# EAGLE design MKR485ShieldV3.0 (EAGLE 9.1.3)
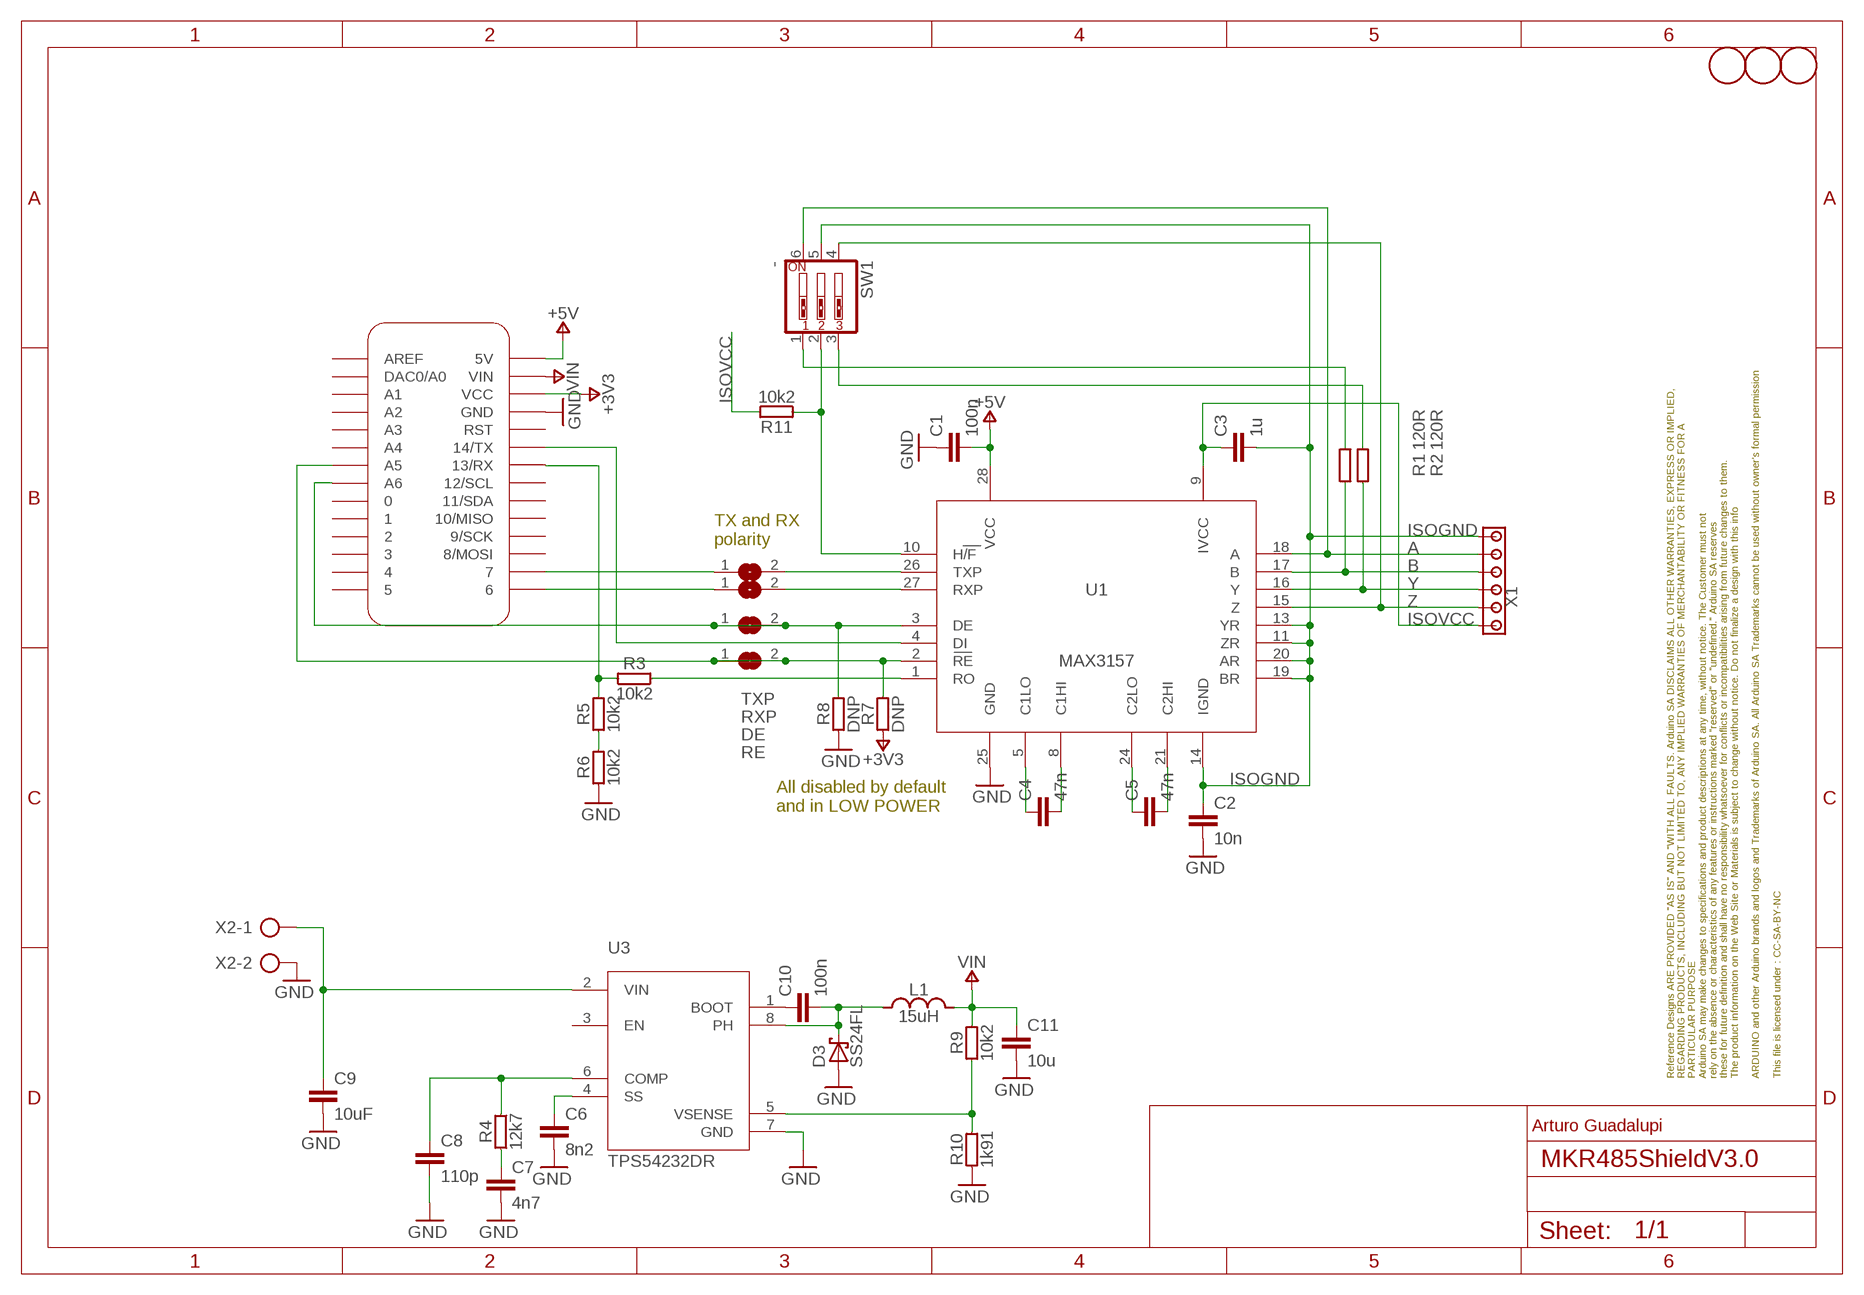
[diagram p0: schematic, sheet 1]

## Parts
C1  100n  C-100NF-0402  [0402-1005X55N]
C2  10n  C-10NF-0603  [0603-1608X90N]
C3  1u  C-1UF-0603  [0603-1608X90N]
C4  47n  C-47N-0402  [0402-1005X55N]
C5  47n  C-47N-0402  [0402-1005X55N]
C6  8n2  C-8N2-0402  [0402-1005X55N]
C7  4n7  C-4N7-0402  [0402-1005X55N]
C8  110p  C-110P-0402  [0402-1005X55N]
C9  10uF  C-10UF-1206  [C1206]
C10  100n  C-100NF-0402  [0402-1005X55N]
C11  10u  C-10UF-0603  [0603-1608X90N]
D3  SS24FL  [SOD123F]
DE  DNP  SJ  [SJ]
FD1  DNP  FIDUCIAL-1.5MM  [FD-1-1.5]
FD2  DNP  FIDUCIAL-1.5MM  [FD-1-1.5]
FD3  DNP  FIDUCIAL-1.5MM  [FD-1-1.5]
FRAME1  DNP  A4L-LOC  [FRAME]
L1  15uH  LSRN  [SRN6045]
MKR1  DNP  MKRBOARD-DNP-DIM  [MKRBOARD-DIM]
R1  120R  R-120R-0402  [0402-1005X55N]
R2  120R  R-120R-0402  [0402-1005X55N]
R3  10k2  R-10K2-0402  [0402-1005X55N]
R4  12k7  R-12K7-0402  [0402-1005X55N]
R5  10k2  R-10K2-0402  [0402-1005X55N]
R6  10k2  R-10K2-0402  [0402-1005X55N]
R7  DNP  R-DNP-0402  [0402-1005X55N]
R8  DNP  R-DNP-0402  [0402-1005X55N]
R9  10k2  R-10K2-0402  [0402-1005X55N]
R10  1k91  R-1K91-0402  [0402-1005X55N]
R11  10k2  R-10K2-0402  [0402-1005X55N]
RE  DNP  SJ  [SJ]
RXP  DNP  SJ  [SJ]
SW1  -  SW_DIP-3  [EDG-03]
TXP  DNP  SJ  [SJ]
U1  MAX3157  [TSSOP28]
U3  TPS54232DR  TPS54232  [SO08]
X1  -  SCREW6X2.54  [SCREW6X2.54]
X2  -  AK300/2  [AK300/2]

## Nets
+3V3: MKR1.VCC R7.1
+5V: C1.2 MKR1.5V U1.28(VCC)
A: SW1.6 U1.18(A) X1.5
B: R1.1 U1.17(B) X1.4
DE: DE.1 DE.2 MKR1.A6 R8.2 U1.3(DE)
GND: C1.1 C2.2 C6.2 C7.2 C8.2 C9.2 C11.2 D3.A MKR1.GND R6.1 R8.1 R10.1 U1.25(GND) U3.7(GND) X2.2
ISOGND: C2.1 C3.2 SW1.5 U1.11(ZR) U1.13(YR) U1.14(IGND) U1.19(BR) U1.20(AR) X1.6
ISOVCC: C3.1 R11.2 U1.9(IVCC) X1.1
N$1: TXP.2 U1.26(TXP)
N$2: RXP.2 U1.27(RXP)
N$3: R11.1 SW1.2 U1.10(H/F)
N$4: R2.2 SW1.3
N$5: MKR1.14(14/TX) U1.4(DI)
N$6: C4.1 U1.5(C1LO)
N$7: C4.2 U1.8(C1HI)
N$8: C5.1 U1.24(C2LO)
N$9: C5.2 U1.21(C2HI)
N$10: C7.1 R4.1
N$11: C8.1 R4.2 U3.6(COMP)
N$12: MKR1.13(13/RX) R3.1 R5.2
N$13: R1.2 SW1.1
N$16: C6.1 U3.4(SS)
N$17: R3.2 U1.1(RO)
N$18 [HV]: C9.1 U3.2(VIN) X2.1
N$19: C10.1 U3.1(BOOT)
N$20: C10.2 D3.C L1.1 U3.8(PH)
N$21: R9.1 R10.2 U3.5(VSENSE)
N$22: R5.1 R6.2
RE: MKR1.A5 R7.2 RE.1 RE.2 U1.2(RE)
RXP: MKR1.6 RXP.1
TXP: MKR1.7 TXP.1
VIN: C11.1 L1.2 MKR1.VIN R9.2
Y: R2.1 U1.16(Y) X1.3
Z: SW1.4 U1.15(Z) X1.2
Unconnected: MKR1.0 MKR1.1 MKR1.2 MKR1.3 MKR1.4 MKR1.5 MKR1.8(8/MOSI) MKR1.9(9/SCK) MKR1.10(10/MISO) MKR1.11(11/SDA) MKR1.12(12/SCL) MKR1.A0(DAC0/A0) MKR1.A1 MKR1.A2 MKR1.A3 MKR1.A4 MKR1.AREF MKR1.RST U3.3(EN)

## Notes on the sheet
- TX and RX
  polarity
- All disabled by default
  and in LOW POWER
- Arturo Guadalupi

## Library data of the parts
C1 C10 = Arduino-rcl:C: SMD Capacitor; CODE-ARDUINO: 0132; DATASHEET: http://www.tdk.com/pdf/TDKMLCCCapRange.pdf; DISTRIBUTOR-LINK: http://www.digikey.com/product-detail/en/tdk-corporation/C1005X5R1H104K050BB/445-5942-1-ND/2443982; DISTRIBUTOR-PN: 445-5942-1-ND; MANUFACTURER: TDK; MANUFACTURER-PN: C1005X5R1H104K050BB; NOTE: -
C2 = Arduino-rcl:C: SMD Capacitor; CODE-ARDUINO: 0142; DATASHEET: http://www.murata.com/~/media/webrenewal/support/library/catalog/products/capacitor/mlcc/c02e.pdf; DISTRIBUTOR-LINK: https://www.digikey.com/product-detail/en/murata-electronics-north-america/GRM188R71H103KA01D/490-1512-1-ND/587862; DISTRIBUTOR-PN: 490-1512-1-ND; MANUFACTURER: Murata; MANUFACTURER-PN: GRM188R71H103KA01D; NOTE: -
C3 = Arduino-rcl:C: SMD Capacitor; CODE-ARDUINO: 0133; DATASHEET: http://www.samsungsem.com/kr/support/product-search/mlcc/__icsFiles/afieldfile/2016/08/18/S_CL10B105KP8NNNC.pdf; DISTRIBUTOR-LINK: https://www.digikey.com/product-detail/en/samsung-electro-mechanics-america-inc/CL10B105KP8NNNC/1276-1946-1-ND/3890032; DISTRIBUTOR-PN: 1276-1946-1-ND; MANUFACTURER: Samsung; MANUFACTURER-PN: CL10B105KP8NNNC; NOTE: -
C4 C5 = Arduino-rcl:C: SMD Capacitor; CODE-ARDUINO: 2216; DATASHEET: http://www.murata.com/~/media/webrenewal/support/library/catalog/products/capacitor/mlcc/c02e.pdf; DISTRIBUTOR-LINK: https://www.digikey.com/product-detail/en/murata-electronics-north-america/GRM155R71E473KA88D/490-3254-1-ND/702795; DISTRIBUTOR-PN: 490-3254-1-ND; MANUFACTURER: Murata; MANUFACTURER-PN: GRM155R71E473KA88D; NOTE: -
C6 = Arduino-rcl:C: SMD Capacitor; CODE-ARDUINO: 2263; DATASHEET: http://www.yageo.com/documents/recent/UPY-GPHC_X7R_6.3V-to-50V_18.pdf; DISTRIBUTOR-LINK: https://www.digikey.com/product-detail/en/yageo/CC0402KRX7R7BB822/311-1041-1-ND/302958; DISTRIBUTOR-PN: 311-1041-1-ND; MANUFACTURER: Yageo; MANUFACTURER-PN: CC0402KRX7R7BB822; NOTE: -
C7 = Arduino-rcl:C: SMD Capacitor; CODE-ARDUINO: 2266; DATASHEET: http://search.murata.co.jp/Ceramy/image/img/A01X/partnumbering_e_01.pdf; DISTRIBUTOR-LINK: https://www.digikey.com/product-detail/en/murata-electronics-north-america/GRM155R71H472KA01J/490-8259-1-ND/4380553; DISTRIBUTOR-PN: 490-8259-1-ND; MANUFACTURER: Murata; MANUFACTURER-PN: GRM155R71H472KA01J; NOTE: -
C8 = Arduino-rcl:C: SMD Capacitor; CODE-ARDUINO: 2264; DATASHEET: http://search.murata.co.jp/Ceramy/image/img/A01X/G101/ENG/GRM1555C1H111GA01-01.pdf; DISTRIBUTOR-LINK: https://www.digikey.com/product-detail/en/murata-electronics-north-america/GRM1555C1H111GA01D/490-6195-1-ND/3845392; DISTRIBUTOR-PN: 490-6195-1-ND; MANUFACTURER: Murata; MANUFACTURER-PN: GRM1555C1H111GA01D; NOTE: -
C9 = Arduino-rcl:C: SMD Capacitor; CODE-ARDUINO: 2227; DATASHEET: https://product.tdk.com/info/en/catalog/datasheets/mlcc_commercial_general_en.pdf; DISTRIBUTOR-LINK: https://www.digikey.com/product-detail/en/tdk-corporation/C3216X7R1V106M160AC/445-8034-1-ND/2792174; DISTRIBUTOR-PN: 445-8034-1-ND; MANUFACTURER: TDK Corporation; MANUFACTURER-PN: C3216X7R1V106M160AC; NOTE: -
C11 = Arduino-rcl:C: SMD Capacitor; CODE-ARDUINO: 2213; DATASHEET: http://www.murata.com/~/media/webrenewal/support/library/catalog/products/capacitor/mlcc/c02e.pdf; DISTRIBUTOR-LINK: http://www.digikey.com/product-search/en?keywords=490-10728-1-ND; DISTRIBUTOR-PN: 490-10728-1-ND; MANUFACTURER: Murata; MANUFACTURER-PN: GRM188R61C106KAALD; NOTE: -
D3 = Arduino-diodes:SS24FL: Schotky diode; CODE-ARDUINO: 2262; DATASHEET: https://www.fairchildsemi.com/datasheets/SS/SS24FL.pdf; DISTRIBUTOR-LINK: https://www.digikey.com/product-detail/en/fairchild-on-semiconductor/SS24FL/SS24FLCT-ND/5305093; DISTRIBUTOR-PN: SS24FLCT-ND; MANUFACTURER: Fairchild; MANUFACTURER-PN: SS24FL
DE RE RXP TXP = Arduino-connectors:SJ: SMD solder JUMPER
FD1-FD3 = Arduino-utility:FIDUCIAL: Fiducial mount; CODE-ARDUINO: DNP; DATASHEET: DNP; DISTRIBUTOR-LINK: DNP; DISTRIBUTOR-PN: DNP; MANUFACTURER: DNP; MANUFACTURER-PN: DNP
FRAME1 = Arduino-utility:A4L-LOC: FRAME DIN A4, landscape with location and doc. field; CODE-ARDUINO: DNP; DATASHEET: DNP; DISTRIBUTOR-LINK: DNP; DISTRIBUTOR-PN: DNP; MANUFACTURER: DNP; MANUFACTURER-PN: DNP
L1 = Arduino-rcl:L: Inductors; CODE-ARDUINO: 2261; DATASHEET: http://pdf1.alldatasheet.com/datasheet-pdf/view/442254/BOURNS/SRN6045-150M.html; DISTRIBUTOR-LINK: https://www.digikey.com/product-detail/en/bourns-inc/SRN6045-150M/SRN6045-150MCT-ND/2756165; DISTRIBUTOR-PN: SRN6045-150M; MANUFACTURER: Bourns; MANUFACTURER-PN: SRN6045-150M
MKR1 = Arduino-utility:MKRBOARD: MKR board footprint; CODE-ARDUINO: DNP; DATASHEET: DNP; DISTRIBUTOR-LINK: DNP; DISTRIBUTOR-PN: DNP; MANUFACTURER: DNP; MANUFACTURER-PN: DNP
R1 R2 = Arduino-rcl:R: SMD Resistor; CODE-ARDUINO: 2278; DATASHEET: www.yageo.com.tw/exep/pages/download/literatures/PYu-R_INT-thick_7.pdf; DISTRIBUTOR-LINK: https://www.digikey.com/product-detail/en/yageo/RC0402JR-07120RL/311-120JRCT-ND/2827967; DISTRIBUTOR-PN: 311-120JRCT-ND; MANUFACTURER: Yageo; MANUFACTURER-PN: RC0402JR-07120RL; NOTE: NO
R3 R5 R6 R9 R11 = Arduino-rcl:R: SMD Resistor; CODE-ARDUINO: 2265; DATASHEET: www.yageo.com.tw/exep/pages/download/literatures/PYu-R_INT-thick_7.pdf; DISTRIBUTOR-LINK: https://www.digikey.com/product-detail/en/yageo/RT0402DRD0710K2L/311-2129-1-ND/6128548; DISTRIBUTOR-PN: 311-2129-1-ND; MANUFACTURER: Yageo; MANUFACTURER-PN: RT0402DRD0710K2L; NOTE: NO
R4 = Arduino-rcl:R: SMD Resistor; CODE-ARDUINO: 2260; DATASHEET: www.yageo.com.tw/exep/pages/download/literatures/PYu-R_INT-thick_7.pdf; DISTRIBUTOR-LINK: https://www.digikey.com/product-detail/en/yageo/RC0402FR-0712K7L/YAG2964CT-ND/5281829; DISTRIBUTOR-PN: YAG2964CT-ND; MANUFACTURER: Yageo; MANUFACTURER-PN: RC0402FR-0712K7L; NOTE: NO
R7 R8 = Arduino-rcl:R: SMD Resistor; CODE-ARDUINO: DNP; DATASHEET: DNP; DISTRIBUTOR-LINK: DNP; DISTRIBUTOR-PN: DNP; MANUFACTURER: DNP; MANUFACTURER-PN: DNP; NOTE: NO
R10 = Arduino-rcl:R: SMD Resistor; CODE-ARDUINO: 2267; DATASHEET: www.yageo.com.tw/exep/pages/download/literatures/PYu-R_INT-thick_7.pdf; DISTRIBUTOR-LINK: https://www.digikey.com/product-detail/en/yageo/RC0402FR-071K91L/YAG3049CT-ND/5281914; DISTRIBUTOR-PN: YAG3049CT-ND; MANUFACTURER: Yageo; MANUFACTURER-PN: RC0402FR-071K91L; NOTE: NO
SW1 = Arduino-mechanical:SW_DIP-3: DIP SWITCH; CODE-ARDUINO: 0277; DATASHEET: https://www.ctscorp.com/wp-content/uploads/219.pdf; DISTRIBUTOR-LINK: https://www.digikey.com/product-detail/en/cts-electrocomponents/219-3MST/CT2193MST-ND/223194; DISTRIBUTOR-PN: CT2193MST-ND; MANUFACTURER: CTS; MANUFACTURER-PN: 219-3MST
U1 = Arduino-ICs:MAX3157: RS485 Transceiver; CODE-ARDUINO: 2268; DATASHEET: https://datasheets.maximintegrated.com/en/ds/MAX3157.pdf; DISTRIBUTOR-LINK: https://www.digikey.com/product-detail/en/maxim-integrated/MAX3157CAI/MAX3157CAI-ND/774103; DISTRIBUTOR-PN: MAX3157CAI+-ND; MANUFACTURER: Maxim; MANUFACTURER-PN: MAX3157CAI+
U3 = Arduino-ICs:TPS54232: Buck converter IC; CODE-ARDUINO: 5423; DATASHEET: http://www.ti.com/lit/ds/symlink/tps54232.pdf; DISTRIBUTOR-LINK: https://www.digikey.com/product-detail/en/texas-instruments/TPS54232DR/296-39414-1-ND/5143365; DISTRIBUTOR-PN: 296-39414-1-ND; MANUFACTURER: Texas Instruments; MANUFACTURER-PN: TPS54232DR; RESTRICTIONS: NO
X1 = Arduino-connectors:SCREW6X2.54: 6x2.54 Screw terminal block; CODE-ARDUINO: 2357; DATASHEET: https://media.digikey.com/pdf/Data%20Sheets/Phoenix%20Contact%20PDFs/1725698.pdf; DISTRIBUTOR-LINK: https://www.digikey.com/product-detail/en/phoenix-contact/1725698/277-1277-ND/267466; DISTRIBUTOR-PN: 277-1277-ND; MANUFACTURER: Phoenix; MANUFACTURER-PN: 1725698
X2 = Arduino-connectors:AK300/2: CONNECTOR; CODE-ARDUINO: 2342; DATASHEET: http://www.on-shore.com/wp-content/uploads/2015/09/osttaxx0161.pdf; DISTRIBUTOR-LINK: https://www.digikey.com/product-detail/en/on-shore-technology-inc/OSTTA020161/ED2561-ND/614512; DISTRIBUTOR-PN: ED2561-ND; MANUFACTURER: On Shore; MANUFACTURER-PN: OSTTA020161

## Net classes
1 HV: clearance 0.3 mm

## Board
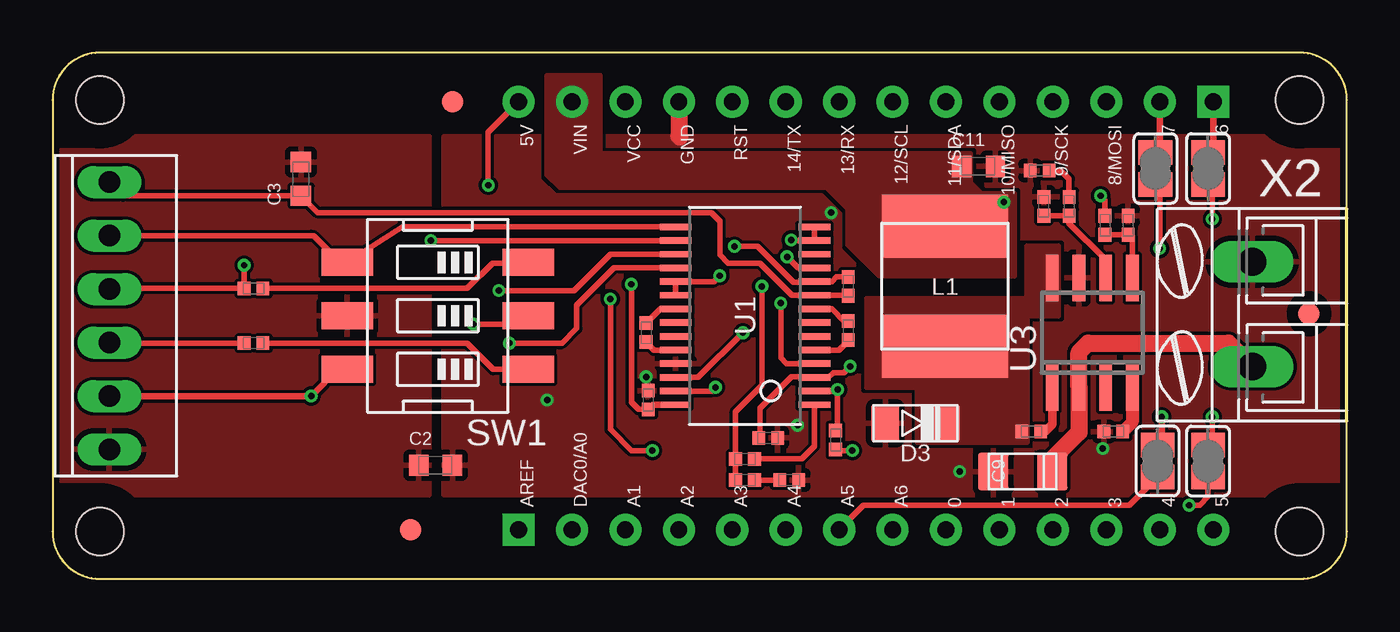
[diagram p1: board, top side]
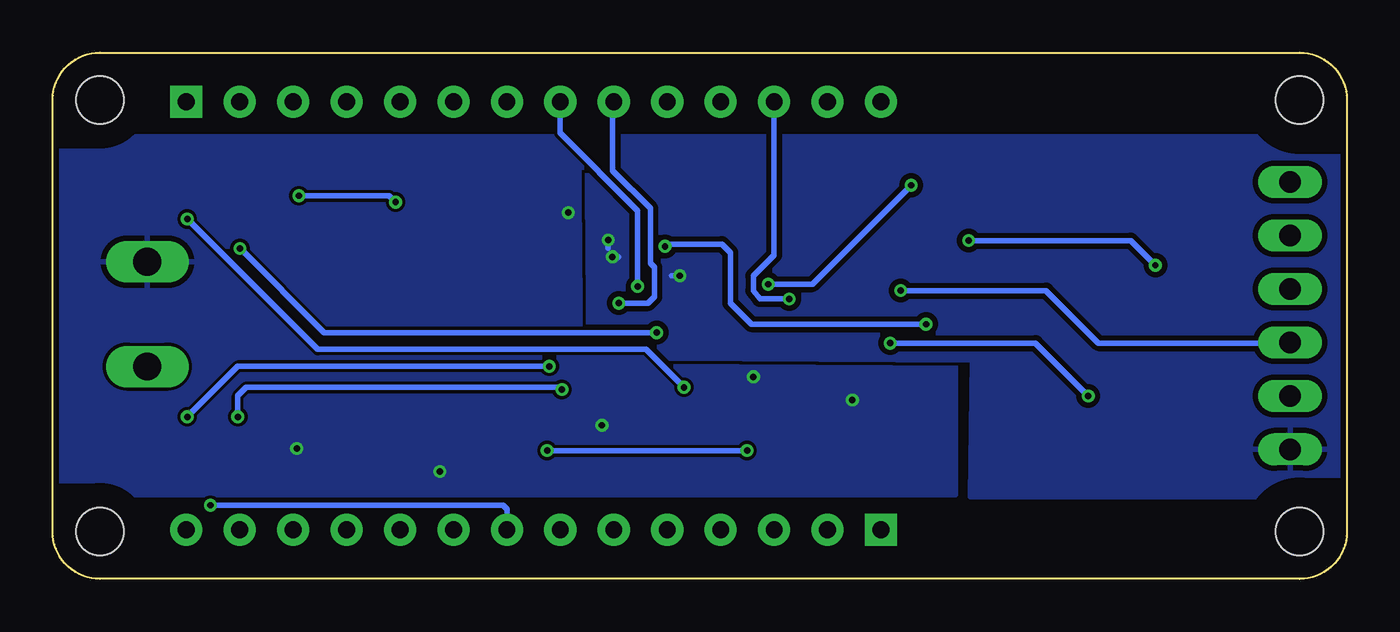
[diagram p2: board, bottom side, seen from below]

Size 61.5 x 25 mm. Coordinates in mm from the lower left corner, seen from the top.
Outline: 0,22.8 0,2.2 arc90 2.2,0 59.2,0 arc90 61.5,2.3 61.5,22.7 arc90 59.2,25 2.2,25
Copper layers (1*16): Top 0.035mm / dielectric 1.5mm / Bottom 0.035mm
Design rules "SeeedStudio_2layers": minimum track width 6mil, minimum drill 12mil, track to track 6mil, track to pad 6mil, pad to pad 6mil, via to via 6mil, smd to smd 0mil, copper to edge 10mil, drill to drill 10mil, minimum pad ring 10mil, minimum via ring 6mil, stop-mask expansion 2mil, vias tented up to drill 100mil, thermal gap 10mil
tRestrict: 1 lines

### Footprints (pad centres in the part's own frame; a part is rotated, then mirrored left to right if it is on the bottom)
0402-1005X55N = smd 0.62 x 0.62: 1 -0.45,0; 2 0.45,0
0603-1608X90N = smd 0.95 x 1: 1 -0.8,0; 2 0.8,0
C1206 = smd 1.8 x 1.45: 1 0,1.4; 2 0,-1.4
SOD123F = smd 1.8 x 1.34: A 0,-1.43; C 0,1.43
SJ = smd 1.168 x 1.6: 1 -0.762,0; 2 0.762,0
FD-1-1.5 = smd 1.016 x 1.016: P$1 0,0
SRN6045 = smd 3 x 6: 1 -2.85,0; 2 2.85,0
MKRBOARD-DIM = drill 0.8 pad 1.524: 0 42.455,2.34; 1 44.995,2.34; 2 47.535,2.34; 3 50.075,2.34; 4 52.615,2.34; 5 55.155,2.34; 5V 22.135,22.66; 7 52.615,22.66; 8 50.075,22.66; 9 47.535,22.66; 10 44.995,22.66; 11 42.455,22.66; 12 39.915,22.66; 13 37.375,22.66; 14 34.835,22.66; A0 24.675,2.34; A1 27.215,2.34; A2 29.755,2.34; A3 32.295,2.34; A4 34.835,2.34; A5 37.375,2.34; A6 39.915,2.34; GND 29.755,22.66; RST 32.295,22.66; VCC 27.215,22.66; VIN 24.675,22.66 | drill 0.8 pad 1.524 square: 6 55.155,22.66; AREF 22.135,2.34 | hole 2.25: 59.25,2.25; 59.25,22.75; 2.25,2.25; 2.25,22.75
EDG-03 = smd 1.27 x 2.435: 1 -2.54,-4.3; 2 0,-4.3; 3 2.54,-4.3; 4 2.54,4.3; 5 0,4.3; 6 -2.54,4.3
TSSOP28 = smd 0.305 x 1.5: 1 -4.225,-3.3; 2 -3.575,-3.3; 3 -2.925,-3.3; 4 -2.275,-3.3; 5 -1.625,-3.3; 6 -0.975,-3.3; 7 -0.325,-3.3; 8 0.325,-3.3; 9 0.975,-3.3; 10 1.625,-3.3; 11 2.275,-3.3; 12 2.925,-3.3; 13 3.575,-3.3; 14 4.225,-3.3; 15 4.225,3.3; 16 3.575,3.3; 17 2.925,3.3; 18 2.275,3.3; 19 1.625,3.3; 20 0.975,3.3; 21 0.325,3.3; 22 -0.325,3.3; 23 -0.975,3.3; 24 -1.625,3.3; 25 -2.275,3.3; 26 -2.925,3.3; 27 -3.575,3.3 | smd 0.305 x 1.4: 28 -4.225,3.3
SO08 = smd 0.6 x 2.2: 1 -1.905,-2.6; 2 -0.635,-2.6; 3 0.635,-2.6; 4 1.905,-2.6; 5 1.905,2.6; 6 0.635,2.6; 7 -0.635,2.6; 8 -1.905,2.6
SCREW6X2.54 = drill 1.016 long: 1 -6.35,0; 2 -3.81,0; 3 -1.27,0; 4 1.27,0; 5 3.81,0; 6 6.35,0
AK300/2 = drill 1.321 long: 1 -2.413,0; 2 2.565,0

### Placement (x,y rotation side)
C1  28.3,8.5 270 top
C2  18.2,5.4 0 top
C3  11.8,19 90 top
C4  37.8,11.8 90 top
C5  28.2,11.7 90 top
C6  50.4,7 180 top
C7  46.9,19.4 180 top
C8  47.1,17.7 90 top
C9  46.1,5.1 270 top
C10  46.5,7 180 top
C11  44,19.6 0 top
D3  41,7.4 270 top
DE  54.9,5.6 270 top
FD1  17,2.34 0 top
FD2  19,22.66 0 top
FD3  59.7,12.6 0 top
FRAME1  -21.7,-10.4 0 top  (outside the outline)
L1  42.4,13.9 90 top
MKR1  0,0 0 top
R1  9.55,11.2 0 top
R2  9.55,13.8 0 top
R3  32.9,5.7 0 top
R4  48.3,17.7 270 top
R5  32.9,4.7 180 top
R6  35,4.7 180 top
R7  37.2,6.6 90 top
R8  34,6.7 180 top
R9  50,16.8 90 top
R10  51.1,16.8 270 top
R11  37.8,13.9 270 top
RE  52.5,5.6 90 top
RXP  54.9,19.5 270 top
SW1  18.3,12.5 90 top
TXP  52.4,19.5 270 top
U1  32.9,12.5 90 top
U3  49.4,11.7 0 top
X1  2.7,12.5 270 top
X2  57,12.5 90 top

### Tracks (layer width: path | path; a pad name or v marks a point on that pad's centre or on a via)
+3V3  (via drill 0.3)
  Top 0.254: v28.5,6.1 27.5,6.1 26.5,7.1 v26.5,13.3 | v38,6.1 37.25,6.1 R7.1
  Bottom 0.254: MKR1.VCC 27.21,15.38 28.2,14.4 28.2,13.7 27.9,13.3 v26.5,13.3 | v38,6.1 v28.5,6.1
+5V  (via drill 0.3)
  Top 0.254: v20.7,18.7 20.7,21.23 MKR1.5V | C1.2 27.85,8.05 27.5,8.4 v27.5,14
  Top 0.305: U1.28 28.52,8.28 C1.2
  Bottom 0.254: v27.5,14 25.4,14 v20.7,18.7
A  (via drill 0.3)
  Top 0.254: U1.18 26.68,14.78 24.9,13 24.9,11.9 24.2,11.2 v21.7,11.2
  Top 0.305: X1.5 v12.29,8.69 13.6,10 14.89,10 SW1.6
  Bottom 0.254: v21.7,11.2 14.8,11.2 v12.29,8.69
B  (via drill 0.3)
  Top 0.254: U1.17 26.5,15.43 24.77,13.7 v21.2,13.7 | R1.1 2.73,11.2 X1.4
  Bottom 0.254: v21.2,13.7 14.3,13.7 11.8,11.2 2.73,11.2 X1.4
DE  (via drill 0.3)
  Top 0.254: v37.9,10.1 37.6,9.8 37.1,9.8 36.88,9.57 U1.3 36.16,9.6 35.1,9.6 33.6,8.1 33.6,6.75 R8.2 | DE.1 55,6.4 55.1,6.5 v55.1,7.7 | v54,3.5 54.5,3.5 54.9,3.9 DE.2
  Top 0.305: DE.2 DE.1
  Bottom 0.254: v37.9,10.1 52.7,10.1 v55.1,7.7 | MKR1.A6 39.91,3.31 40.1,3.5 v54,3.5
GND  (via drill 0.3)
  Top 0.813: MKR1.GND 29.75,21.05 29.8,21
  other vias: 23.5,8.5 28.2,9.6 35.4,7.3 37,17.4 43.1,5.1 49.9,6.2
  pour Top (rank 6): 18.6,21 18.6,4 62,4 62,21
  pour Bottom (rank 6): 18.6,21 18.6,4 62,4 62,21
ISOGND  (via drill 0.3)
  Top 0.254: U1.14 U1.13 35.17,16.07 v35.1,16.1 | U1.11 35.42,14.78 v34.9,15.3 | U1.20 U1.19 31.43,14.12 v31.7,14.4
  Bottom 0.254: v35.1,16.1 35.1,15.7 | v34.9,15.3 34.67,15.22 34.6,15.3 | v31.7,14.4 32.1,14.4
  pour Top: 17.9,4 17.9,21 0,21 0,4
  pour Bottom (isolate 0.254): 36,10.5 36.1,21 0.1,21 0.1,3.9 17.9,3.9 17.8,10.4
ISOVCC
  Top 0.254: X1.1 3.35,18.2 C3.1 12.6,17.4 31.3,17.4 31.7,17 31.7,15.4 32.1,15 33.6,15 35.12,13.47 U1.9 37.77,13.47 R11.2
N$1  (via drill 0.3)
  Top 0.254: U1.26 30.68,9.57 v32.8,11.7 | TXP.2 52.6,18.74 v52.6,15.7
  Bottom 0.254: v32.8,11.7 48.6,11.7 v52.6,15.7
N$2  (via drill 0.3)
  Top 0.254: U1.27 31.32,8.93 v31.5,9.1 | RXP.2 55.1,18.74 v55.1,17.1
  Bottom 0.254: v31.5,9.1 33.3,10.9 48.9,10.9 v55.1,17.1
N$3  (via drill 0.3)
  Top 0.254: v32.4,15.8 33.5,15.8 35.2,14.1 36.29,14.1 U1.10 37.03,14.12 37.25,14.35 R11.1 | SW1.2 22.07,12.1 v20,12.1
  Bottom 0.254: v32.4,15.8 32.3,15.9 29.7,15.9 29.3,15.5 29.3,13.1 28.3,12.1 v20,12.1
N$4
  Top 0.254: R2.2 19.7,13.8 20.9,15 22.56,15 SW1.3
N$5  (via drill 0.3)
  Top 0.254: U1.4 34.88,10.22 34.6,10.5 v34.6,13.1
  Bottom 0.254: v34.6,13.1 33.2,13.1 32.9,13.4 32.9,14.8 33.1,15 33.1,17.6 34.9,19.4 34.9,22.59 MKR1.14
N$6
  Top 0.254: U1.5 37.38,10.88 37.8,11.3 C4.1
N$7
  Top 0.254: U1.8 37.02,12.82 37.6,12.25 C4.2
N$8
  Top 0.254: U1.24 28.57,10.88 C5.1
N$9
  Top 0.254: U1.21 28.88,12.82 C5.2
N$10
  Top 0.254: R4.1 48.3,19 47.9,19.4 C7.1
N$11
  Top 0.254: C8.1 R4.2 48.3,16.9 50,15.2 50,14.34 U3.6
N$12  (via drill 0.3)
  Top 0.254: R5.2 R3.1 32.45,7.95 33.7,9.2 v33.7,13.9
  Bottom 0.254: v33.7,13.9 33.7,17.5 37.4,21.2 37.4,22.64 MKR1.13
N$13
  Top 0.254: SW1.1 20.94,9.96 19.7,11.2 R1.2
N$16
  Top 0.61: U3.4 51.3,7.46 C6.1
N$17
  Top 0.254: U1.1 36.2,8.26 36.2,6.3 35.6,5.7 R3.2
N$18
  Top 0.813: X2.1 55.89,11.2 49.2,11.2 48.77,10.77 U3.2 48.77,6.96 47.5,5.7 C9.1
N$19
  Top 0.406: C10.1 47.15,7 47.49,7.34 U3.1
N$20
  pour Top (no thermals): 38.7,13.3 38.7,9.1 41.1,9.1 41.1,6.5 46.3,6.5 46.3,12.5 47.8,12.5 47.8,15.8 46.3,15.8 46.3,13.3
N$21
  Top 0.254: U3.5 51.3,16.25 R10.2 R9.1
N$22
  Top 0.254: R5.1 R6.2
RE  (via drill 0.3)
  Top 0.254: U1.2 37.12,8.93 v37.3,9 37.3,7.15 R7.2 | MKR1.A5 38.53,3.5 51.16,3.5 RE.1
  Top 0.305: RE.1 RE.2 52.7,6.4 v52.7,7.7
  Bottom 0.254: v52.7,7.7 52.7,8.7 52.3,9.1 37.4,9.1 v37.3,9
RXP
  Top 0.305: RXP.1 55.16,20.26 MKR1.6
TXP
  Top 0.305: TXP.1 52.62,20.26 MKR1.7
VIN  (via drill 0.3)
  Top 0.254: R9.2 50,18 v49.8,18.2 | v45.2,17.9 44.5,17.9
  Bottom 0.254: v49.8,18.2 45.5,18.2 v45.2,17.9
  pour Top (isolate 0.254, no thermals): 23.5,23.9 23.5,19.2 24.1,18.6 36.8,18.6 37.8,17.6 37.8,15.9 39.3,14.4 45.7,14.4 45.7,18.3 44.1,18.3 43.6,18.8 43.6,20.2 26,20.2 26,23.9
Y  (via drill 0.3)
  Top 0.254: U1.16 v17.98,16.07 | X1.3 2.73,13.8 R2.1 v9.1,14.9
  Bottom 0.254: v17.98,16.07 10.28,16.07 v9.1,14.9
Z
  Top 0.254: X1.2 12.29,16.31 12.4,16.3 13.66,15.04 SW1.4 16.62,16.73 U1.15

### Text on the board
Notes: Arturo Guadalupi